# EasyEDA Pro project grandPA2.eprj, board main
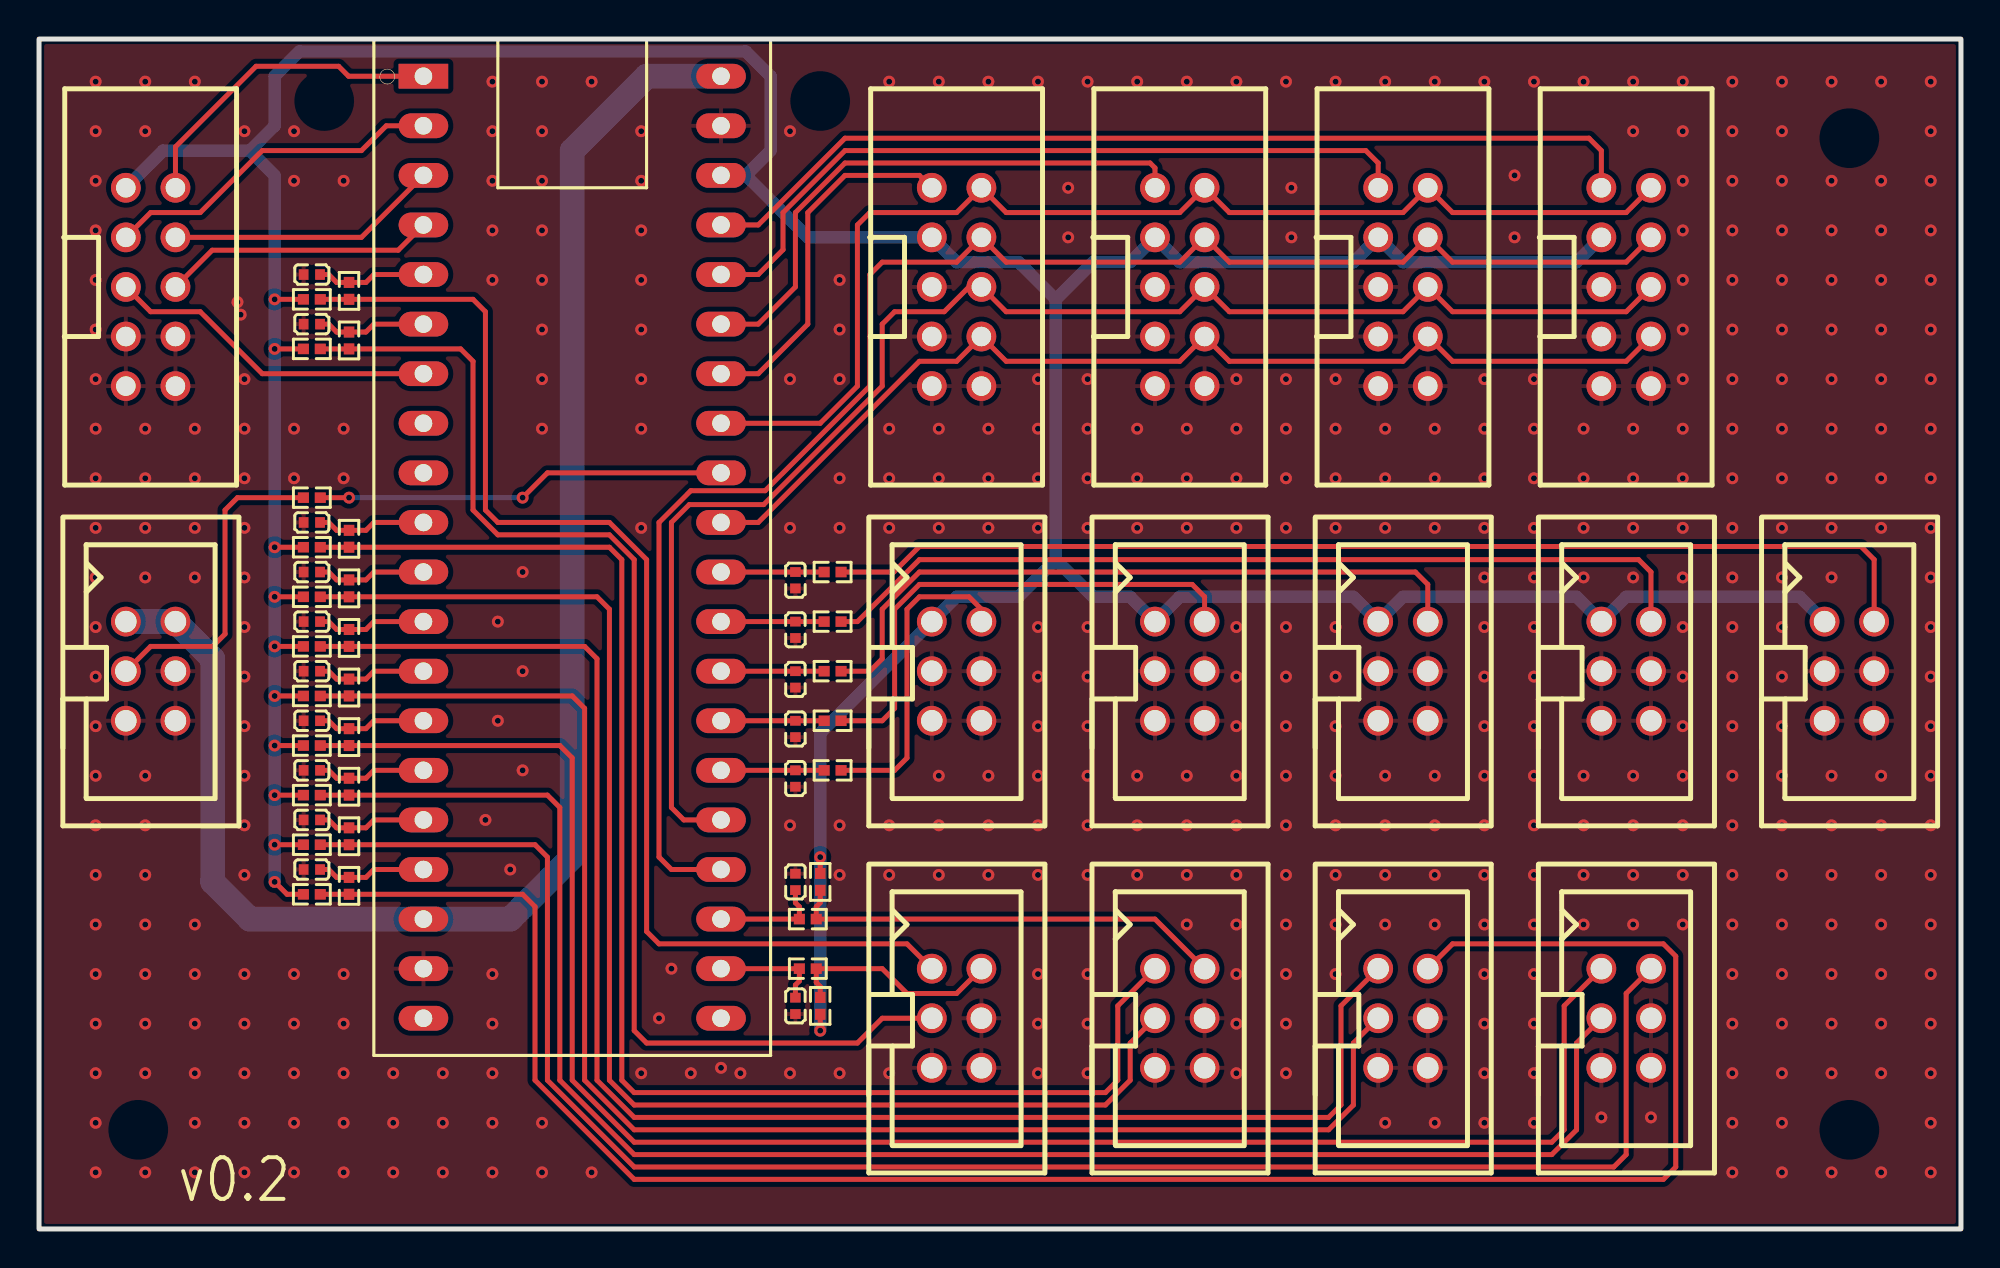
[diagram p8: board, top side]
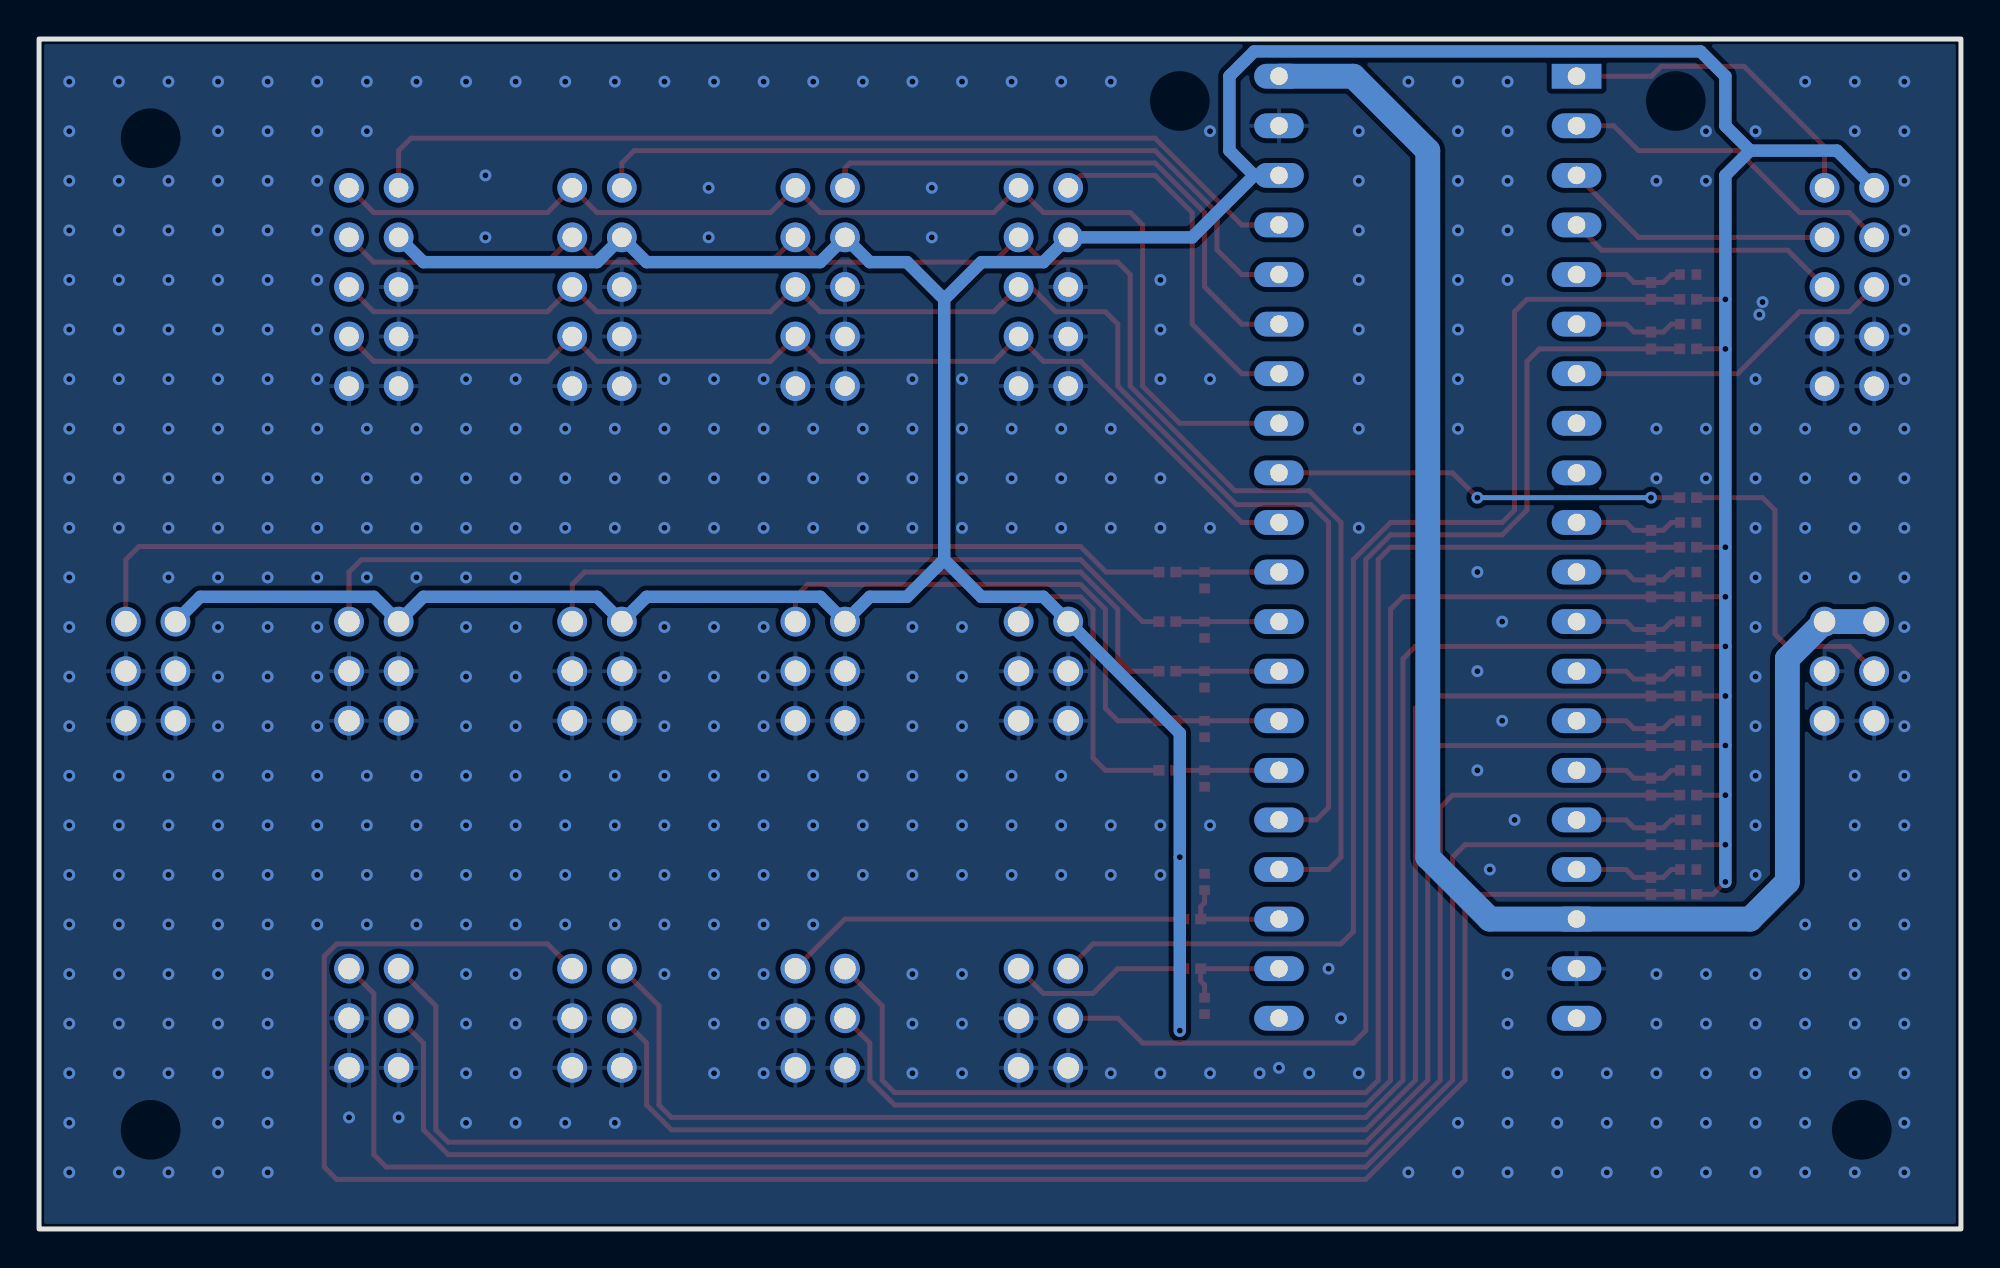
[diagram p9: board, bottom side, seen from below]

Outline 98.42 x 60.96 mm; copper layers: Top Layer, Bottom Layer. Coordinates in mm from the lower left corner of the outline.
Outline path: rectangle 0,60.96 98.42,0
Stack: Top Layer 0.035mm / Dielectric1 1.51mm FR4 er 4.5 / Bottom Layer 0.035mm

## Design rules (mm)
template: JLCPCB Capability(Two Layers Board)
spacing copperThickness1oz (default): track to track 0.102, other pairs 0.152 to 0.3
spacing copperThickness2oz: track to track 0.203, other pairs 0.152 to 0.3
track width copperThickness1oz (default): min 0.127, default 0.254, max 2.54
track width copperThickness2oz: min 0.203, default 0.254, max 2.54
differential pair differentialPair (default): width min 0.127, default 0.254, max 2.54; gap min 0.152, default 0.152
via viaSize (default): diameter min 0.5, default 0.61, max 10; hole min 0.3, default 0.305, max 6.3

## Placement (name value [footprint] x y rotation side)
C3  10nF  [C0402]  13.97 46.36 0 top
C5  100nF  [C0402]  38.73 11.43 270 top
C6  10nF  [C0402]  13.97 48.9 0 top
C7  100nF  [C0402]  38.73 33.24 270 top
C17  100nF  [C0402]  38.73 23.08 270 top
C18  100nF  [C0402]  38.73 25.62 270 top
C19  100nF  [C0402]  38.73 28.16 270 top
C20  100nF  [C0402]  38.73 30.7 270 top
C21  10nF  [C0402]  13.97 36.2 0 top
C22  100nF  [C0402]  38.73 17.78 90 top
C23  10nF  [C0402]  13.97 33.66 0 top
C27  10nF  [C0402]  13.97 26.04 0 top
C28  100nF  [C0402]  13.97 20.96 180 top
C29  10nF  [C0402]  13.97 23.5 0 top
C30  10nF  [C0402]  13.97 31.12 0 top
C31  100nF  [C0402]  13.97 18.42 180 top
C32  10nF  [C0402]  13.97 28.58 0 top
P6  2.54-2*5P简牛  [IDC-TH_10P-P2.54_C5665]  5.72 48.26 270 top
P7  2.54-2*3P简牛  [IDC-TH_6P-P2.54_C11214]  5.72 28.58 270 top
P12  2.54-2*3P简牛  [IDC-TH_6P-P2.54_C11214]  46.99 10.8 270 top
P13  2.54-2*3P简牛  [IDC-TH_6P-P2.54_C11214]  92.71 28.58 270 top
P18  2.54-2*3P简牛  [IDC-TH_6P-P2.54_C11214]  58.42 10.8 270 top
P19  2.54-2*3P简牛  [IDC-TH_6P-P2.54_C11214]  69.85 10.8 270 top
P20  2.54-2*3P简牛  [IDC-TH_6P-P2.54_C11214]  81.28 10.8 270 top
P21  2.54-2*5P简牛  [IDC-TH_10P-P2.54_C5665]  46.99 48.26 270 top
P22  2.54-2*5P简牛  [IDC-TH_10P-P2.54_C5665]  69.85 48.26 270 top
P23  2.54-2*5P简牛  [IDC-TH_10P-P2.54_C5665]  58.42 48.26 270 top
P24  2.54-2*5P简牛  [IDC-TH_10P-P2.54_C5665]  81.28 48.26 270 top
P25  2.54-2*3P简牛  [IDC-TH_6P-P2.54_C11214]  46.99 28.58 270 top
P26  2.54-2*3P简牛  [IDC-TH_6P-P2.54_C11214]  58.42 28.58 270 top
P27  2.54-2*3P简牛  [IDC-TH_6P-P2.54_C11214]  69.85 28.58 270 top
P28  2.54-2*3P简牛  [IDC-TH_6P-P2.54_C11214]  81.28 28.58 270 top
R1  470Ω  [R0402]  13.97 37.47 180 top
R5  1kΩ  [R0402]  39.37 13.34 0 top
R6  10kΩ  [R0402]  13.97 45.09 180 top
R7  10kΩ  [R0402]  15.88 45.52 270 top
R9  10kΩ  [R0402]  13.97 47.63 180 top
R10  10kΩ  [R0402]  15.88 48.06 270 top
R11  10kΩ  [R0402]  40.01 11.43 270 top
R12  1kΩ  [R0402]  40.64 33.66 0 top
R31  1kΩ  [R0402]  40.64 23.5 0 top
R32  1kΩ  [R0402]  40.64 26.04 0 top
R33  1kΩ  [R0402]  40.64 28.58 0 top
R34  1kΩ  [R0402]  40.64 31.12 0 top
R35  10kΩ  [R0402]  13.97 34.93 180 top
R36  10kΩ  [R0402]  15.88 35.36 270 top
R37  1kΩ  [R0402]  39.37 15.88 0 top
R38  10kΩ  [R0402]  40.01 17.78 90 top
R39  10kΩ  [R0402]  13.97 32.39 180 top
R40  10kΩ  [R0402]  15.88 32.82 270 top
R47  10kΩ  [R0402]  13.97 24.77 180 top
R48  10kΩ  [R0402]  15.88 25.2 270 top
R49  1kΩ  [R0402]  15.88 20.12 270 top
R50  10kΩ  [R0402]  13.97 19.69 180 top
R51  10kΩ  [R0402]  13.97 22.23 180 top
R52  10kΩ  [R0402]  15.88 22.66 270 top
R53  10kΩ  [R0402]  13.97 29.85 180 top
R54  10kΩ  [R0402]  15.88 30.28 270 top
R55  1kΩ  [R0402]  15.88 17.58 270 top
R56  10kΩ  [R0402]  13.97 17.15 180 top
R57  10kΩ  [R0402]  13.97 27.31 180 top
R58  10kΩ  [R0402]  15.88 27.74 270 top
U1  BlackPill  [Z_module_black_pill_STM32F411]  27.31 34.93 270 top

## Footprints (pads in the part's own frame, mm; a bottom-side part is the same pattern mirrored in y, then rotated)
C0402
  rect 0.5x0.54 smd: 1(-0.42,0) 2(0.42,0)
IDC-TH_6P-P2.54_C11214
  round 1.524 hole 1.1: 1(-2.54,-1.27) 2(-2.54,1.27) 3(0,-1.27) 4(0,1.27) 5(2.54,-1.27) 6(2.54,1.27)
IDC-TH_10P-P2.54_C5665
  round 1.524 hole 1: 1(-5.08,-1.27) 2(-5.08,1.27) 3(-2.54,-1.27) 4(-2.54,1.27) 5(0,-1.27) 6(0,1.27) 7(2.54,-1.27) 8(2.54,1.27) 9(5.08,-1.27) 10(5.08,1.27)
R0402
  rect 0.566x0.54 smd: 1(-0.433,0) 2(0.433,0)
Z_module_black_pill_STM32F411
  rect 1.27x2.54 hole 0.9: 1(-24.13,-7.62)
  oval 1.27x2.54 hole 0.9: 2(-21.59,-7.62) 3(-19.05,-7.62) 4(-16.51,-7.62) 5(-13.97,-7.62) 6(-11.43,-7.62) 7(-8.89,-7.62) 8(-6.35,-7.62) 9(-3.81,-7.62) 10(-1.27,-7.62) 11(1.27,-7.62) 12(3.81,-7.62) 13(6.35,-7.62) 14(8.89,-7.62) 15(11.43,-7.62) 16(13.97,-7.62) 17(16.51,-7.62) 18(19.05,-7.62) 19(21.59,-7.62) 20(24.13,-7.62) 21(24.13,7.62) 22(21.59,7.62) 23(19.05,7.62) 24(16.51,7.62) 25(13.97,7.62) 26(11.43,7.62) 27(8.89,7.62) 28(6.35,7.62) 29(3.81,7.62) 30(1.27,7.62) 31(-1.27,7.62) 32(-3.81,7.62) 33(-6.35,7.62) 34(-8.89,7.62) 35(-11.43,7.62) 36(-13.97,7.62) 37(-16.51,7.62) 38(-19.05,7.62) 39(-21.59,7.62) 40(-24.13,7.62)

## Nets
As in the schematic.

Pads without a net: U1 8 9 20 21

## Via types
v1: diameter 0.61, hole 0.305, Top Layer to Bottom Layer, 468 vias

## Routing (per net, layer and track width the routed paths; a pad name or vN(x,y) marks a point on that pad's centre or on a via; arc(x,y) is an arc through that point)
3V3: length 237.5
  Top Layer w0.254: R39.2 v1(12.07,32.39) ; R50.2 v1(12.07,19.69) ; R9.2 v1(12.07,47.63) ; R35.2 v1(12.07,34.93) ; R6.2 v1(12.07,45.09) ; R56.2 12.7,17.15 v1(12.07,17.78) ; R57.2 v1(12.07,27.31) ; R51.2 v1(12.07,22.23) ; R53.2 v1(12.07,29.85) ; R11.2 v1(40.01,10.16) ; R47.2 v1(12.07,24.77) ; R38.2 v1(40.01,19.05)
  Bottom Layer w0.635: v1(40.01,10.16) v1(40.01,19.05) 40.01,25.4 P25.1 46.99,32.39 50.17,32.39 52.07,34.29 ; P24.3 78.74,49.53 69.85,49.53 P22.3 67.31,49.53 58.42,49.53 57.15,50.8 55.88,49.53 53.98,49.53 52.07,47.63 ; 52.07,47.63 52.07,34.29 ; 52.07,47.63 50.17,49.53 46.99,49.53 P21.3 39.37,50.8 36.2,53.98 ; 52.07,34.29 53.98,32.39 55.88,32.39 57.15,31.12 58.42,32.39 67.31,32.39 P27.1 69.85,32.39 78.74,32.39 P28.1 81.28,32.39 90.17,32.39 P13.1 ; 36.2,53.98 37.47,55.25 37.47,59.06 36.2,60.33 13.34,60.33 12.07,59.06 12.07,56.52 10.8,55.25 ; 36.2,53.98 U1.38 ; 10.8,55.25 6.35,55.25 P6.1 ; 10.8,55.25 12.07,53.98 v1(12.07,47.63) v1(12.07,45.09) v1(12.07,34.93) v1(12.07,32.39) v1(12.07,29.85) v1(12.07,27.31) v1(12.07,24.77) v1(12.07,22.23) v1(12.07,19.69) v1(12.07,17.78)
5V: length 82.6
  Bottom Layer w1.27: P7.1 P7.2 8.89,29.21 8.89,17.78 10.8,15.88 U1.18 24.13,15.88 27.31,19.05 27.31,55.25 31.12,59.06 U1.40
GND:
  vias: v1(2.9,58.78) v1(2.9,56.24) v1(2.9,53.7) v1(2.9,51.16) v1(2.9,48.62) v1(2.9,46.08) v1(2.9,43.54) v1(2.9,41) v1(2.9,38.46) v1(2.9,35.92) v1(2.9,33.38) v1(2.9,30.84) v1(2.9,28.3) v1(2.9,25.76) v1(2.9,23.22) v1(2.9,20.68) v1(2.9,18.14) v1(2.9,15.6) v1(2.9,13.06) v1(2.9,10.52) v1(2.9,7.98) v1(2.9,5.44) v1(2.9,2.9) v1(5.44,58.78) v1(5.44,56.24) v1(5.44,41) v1(5.44,38.46) v1(5.44,35.92) v1(5.44,33.38) v1(5.44,23.22) v1(5.44,20.68) v1(5.44,18.14) v1(5.44,15.6) v1(5.44,13.06) v1(5.44,10.52) v1(5.44,7.98) v1(5.44,2.9) v1(7.98,58.78) v1(7.98,41) v1(7.98,38.46) v1(7.98,35.92) v1(7.98,33.38) v1(7.98,15.6) v1(7.98,13.06) v1(7.98,10.52) v1(7.98,7.98) v1(7.98,5.44) v1(7.98,2.9) v1(10.16,47.48) v1(10.32,46.84) v1(10.52,56.24) v1(10.52,43.54) v1(10.52,41) v1(10.52,38.46) v1(10.52,35.92) v1(10.52,33.38) v1(10.52,30.84) v1(10.52,28.3) v1(10.52,25.76) v1(10.52,23.22) v1(10.52,20.68) v1(10.52,18.14) v1(10.52,13.06) v1(10.52,10.52) v1(10.52,7.98) v1(10.52,5.44) v1(10.52,2.9) v1(13.06,56.24) v1(13.06,53.7) v1(13.06,41) v1(13.06,38.46) v1(13.06,13.06) v1(13.06,10.52) v1(13.06,7.98) v1(13.06,5.44) v1(13.06,2.9) v1(15.6,53.7) v1(15.6,41) v1(15.6,38.46) v1(15.6,13.06) v1(15.6,10.52) v1(15.6,7.98) v1(15.6,5.44) v1(15.6,2.9) v1(18.14,7.98) v1(18.14,5.44) v1(18.14,2.9) v1(20.68,7.98) v1(20.68,5.44) v1(20.68,2.9) v1(22.86,20.96) v1(23.22,58.78) v1(23.22,56.24) v1(23.22,53.7) v1(23.22,51.16) v1(23.22,48.62) v1(23.22,13.06) v1(23.22,10.52) v1(23.22,7.98) v1(23.22,5.44) v1(23.22,2.9) v1(23.5,31.12) v1(23.5,26.04) v1(24.13,18.42) v1(24.77,33.66) v1(24.77,28.58) v1(24.77,23.5) v1(25.76,58.78) v1(25.76,56.24) v1(25.76,53.7) v1(25.76,51.16) v1(25.76,48.62) v1(25.76,46.08) v1(25.76,43.54) v1(25.76,41) v1(25.76,5.44) v1(25.76,2.9) v1(28.3,58.78) v1(28.3,2.9) v1(30.84,56.24) v1(30.84,53.7) v1(30.84,51.16) v1(30.84,48.62) v1(30.84,46.08) v1(30.84,43.54) v1(30.84,41) v1(30.84,35.92) v1(30.84,7.98) v1(31.75,10.8) v1(32.39,13.34) v1(33.38,7.98) v1(34.92,8.26) v1(35.92,7.98) v1(38.46,56.24) v1(38.46,43.54) v1(38.46,35.92) v1(38.46,20.68) v1(38.46,7.98) v1(41,48.62) v1(41,46.08) v1(41,43.54) v1(41,38.46) v1(41,35.92) v1(41,20.68) v1(41,18.14) v1(41,7.98) v1(43.54,58.78) v1(43.54,41) v1(43.54,38.46) v1(43.54,35.92) v1(43.54,20.68) v1(43.54,18.14) v1(43.54,7.98) v1(46.08,58.78) v1(46.08,41) v1(46.08,38.46) v1(46.08,35.92) v1(46.08,23.22) v1(46.08,20.68) v1(46.08,18.14) v1(48.62,58.78) v1(48.62,41) v1(48.62,38.46) v1(48.62,35.92) v1(48.62,23.22) v1(48.62,20.68) v1(48.62,18.14) v1(51.16,58.78) v1(51.16,43.54) v1(51.16,41) v1(51.16,38.46) v1(51.16,35.92) v1(51.16,30.84) v1(51.16,28.3) v1(51.16,25.76) v1(51.16,23.22) v1(51.16,20.68) v1(51.16,18.14) v1(51.16,13.06) v1(51.16,10.52) v1(51.16,7.98) v1(52.7,53.34) v1(52.7,50.8) v1(53.7,58.78) v1(53.7,43.54) v1(53.7,41) v1(53.7,38.46) v1(53.7,35.92) v1(53.7,30.84) v1(53.7,28.3) v1(53.7,25.76) v1(53.7,23.22) v1(53.7,20.68) v1(53.7,18.14) v1(53.7,13.06) v1(53.7,10.52) v1(53.7,7.98) v1(56.24,58.78) v1(56.24,41) v1(56.24,38.46) v1(56.24,35.92) v1(56.24,23.22) v1(56.24,20.68) v1(56.24,18.14) v1(58.78,58.78) v1(58.78,41) v1(58.78,38.46) v1(58.78,35.92) v1(58.78,23.22) v1(58.78,20.68) v1(58.78,18.14) v1(58.78,15.6) v1(61.32,58.78) v1(61.32,43.54) v1(61.32,41) v1(61.32,38.46) v1(61.32,35.92) v1(61.32,30.84) v1(61.32,28.3) v1(61.32,25.76) v1(61.32,23.22) v1(61.32,20.68) v1(61.32,18.14) v1(61.32,15.6) v1(61.32,13.06) v1(61.32,10.52) v1(61.32,7.98) v1(63.86,58.78) v1(63.86,43.54) v1(63.86,41) v1(63.86,38.46) v1(63.86,35.92) v1(63.86,30.84) v1(63.86,28.3) v1(63.86,25.76) v1(63.86,23.22) v1(63.86,20.68) v1(63.86,18.14) v1(63.86,15.6) v1(63.86,13.06) v1(63.86,10.52) v1(63.86,7.98) v1(64.14,53.34) v1(64.14,50.8) v1(66.4,58.78) v1(66.4,43.54) v1(66.4,41) v1(66.4,38.46) v1(66.4,35.92) v1(66.4,30.84) v1(66.4,28.3) v1(66.4,25.76) v1(66.4,23.22) v1(66.4,20.68) v1(66.4,18.14) v1(66.4,15.6) v1(66.4,13.06) v1(68.94,58.78) v1(68.94,41) v1(68.94,38.46) v1(68.94,35.92) v1(68.94,23.22) v1(68.94,20.68) v1(68.94,18.14) v1(68.94,15.6) v1(68.94,5.44) v1(71.48,58.78) v1(71.48,41) v1(71.48,38.46) v1(71.48,35.92) v1(71.48,23.22) v1(71.48,20.68) v1(71.48,18.14) v1(71.48,15.6) v1(71.48,5.44) v1(74.02,58.78) v1(74.02,43.54) v1(74.02,41) v1(74.02,38.46) v1(74.02,35.92) v1(74.02,33.38) v1(74.02,30.84) v1(74.02,28.3) v1(74.02,25.76) v1(74.02,23.22) v1(74.02,20.68) v1(74.02,18.14) v1(74.02,15.6) v1(74.02,13.06) v1(74.02,10.52) v1(74.02,7.98) v1(74.02,5.44) v1(75.57,53.98) v1(75.57,50.8) v1(76.56,58.78) v1(76.56,43.54) v1(76.56,41) v1(76.56,38.46) v1(76.56,35.92) v1(76.56,33.38) v1(76.56,30.84) v1(76.56,28.3) v1(76.56,25.76) v1(76.56,23.22) v1(76.56,20.68) v1(76.56,18.14) v1(76.56,15.6) v1(76.56,13.06) v1(76.56,10.52) v1(76.56,7.98) v1(76.56,5.44) v1(79.1,58.78) v1(79.1,41) v1(79.1,38.46) v1(79.1,35.92) v1(79.1,33.38) v1(79.1,23.22) v1(79.1,20.68) v1(79.1,18.14) v1(79.1,15.6) v1(80.01,5.72) v1(81.64,58.78) v1(81.64,56.24) v1(81.64,41) v1(81.64,38.46) v1(81.64,35.92) v1(81.64,33.38) v1(81.64,23.22) v1(81.64,20.68) v1(81.64,18.14) v1(81.64,15.6) v1(82.55,5.72) v1(84.18,58.78) v1(84.18,56.24) v1(84.18,53.7) v1(84.18,51.16) v1(84.18,48.62) v1(84.18,46.08) v1(84.18,43.54) v1(84.18,41) v1(84.18,38.46) v1(84.18,35.92) v1(84.18,33.38) v1(84.18,30.84) v1(84.18,28.3) v1(84.18,25.76) v1(84.18,23.22) v1(84.18,20.68) v1(84.18,18.14) v1(84.18,15.6) v1(86.72,58.78) v1(86.72,56.24) v1(86.72,53.7) v1(86.72,51.16) v1(86.72,48.62) v1(86.72,46.08) v1(86.72,43.54) v1(86.72,41) v1(86.72,38.46) v1(86.72,35.92) v1(86.72,33.38) v1(86.72,30.84) v1(86.72,28.3) v1(86.72,25.76) v1(86.72,23.22) v1(86.72,20.68) v1(86.72,18.14) v1(86.72,15.6) v1(86.72,13.06) v1(86.72,10.52) v1(86.72,7.98) v1(86.72,5.44) v1(86.72,2.9) v1(89.26,58.78) v1(89.26,56.24) v1(89.26,53.7) v1(89.26,51.16) v1(89.26,48.62) v1(89.26,46.08) v1(89.26,43.54) v1(89.26,41) v1(89.26,38.46) v1(89.26,35.92) v1(89.26,33.38) v1(89.26,30.84) v1(89.26,28.3) v1(89.26,25.76) v1(89.26,23.22) v1(89.26,20.68) v1(89.26,18.14) v1(89.26,15.6) v1(89.26,13.06) v1(89.26,10.52) v1(89.26,7.98) v1(89.26,5.44) v1(89.26,2.9) v1(91.8,58.78) v1(91.8,53.7) v1(91.8,51.16) v1(91.8,48.62) v1(91.8,46.08) v1(91.8,43.54) v1(91.8,41) v1(91.8,38.46) v1(91.8,35.92) v1(91.8,33.38) v1(91.8,23.22) v1(91.8,20.68) v1(91.8,18.14) v1(91.8,15.6) v1(91.8,13.06) v1(91.8,10.52) v1(91.8,7.98) v1(91.8,2.9) v1(94.34,58.78) v1(94.34,53.7) v1(94.34,51.16) v1(94.34,48.62) v1(94.34,46.08) v1(94.34,43.54) v1(94.34,41) v1(94.34,38.46) v1(94.34,35.92) v1(94.34,23.22) v1(94.34,20.68) v1(94.34,18.14) v1(94.34,15.6) v1(94.34,13.06) v1(94.34,10.52) v1(94.34,7.98) v1(94.34,2.9) v1(96.88,58.78) v1(96.88,56.24) v1(96.88,53.7) v1(96.88,51.16) v1(96.88,48.62) v1(96.88,46.08) v1(96.88,43.54) v1(96.88,41) v1(96.88,38.46) v1(96.88,35.92) v1(96.88,33.38) v1(96.88,30.84) v1(96.88,28.3) v1(96.88,25.76) v1(96.88,23.22) v1(96.88,20.68) v1(96.88,18.14) v1(96.88,15.6) v1(96.88,13.06) v1(96.88,10.52) v1(96.88,7.98) v1(96.88,5.44) v1(96.88,2.9)
DP0_CS: length 18.6
  Top Layer w0.254: P21.1 45.08,53.98 41.28,53.98 39.37,52.07 39.37,46.36 36.83,43.82 U1.34
DP1_CS: length 29
  Top Layer w0.254: U1.35 36.83,46.36 38.73,48.26 38.73,52.07 41.28,54.61 56.9,54.61 57.15,54.36 57.15,53.34
DP2_CS: length 38.9
  Top Layer w0.254: U1.36 36.83,48.9 38.1,50.17 38.1,52.07 41.28,55.25 67.95,55.25 68.58,54.61 P22.1
DP3_CS: length 49.1
  Top Layer w0.254: U1.37 36.83,51.44 41.28,55.88 79.38,55.88 80.01,55.25 P24.1
DP_DC: length 83.9
  Top Layer w0.254: U1.24 32.39,18.42 31.75,19.05 31.75,36.2 33.38,37.82 37.19,37.82 42.55,43.18 42.55,48.9 43.18,49.53 46.99,49.53 P21.4 49.53,49.53 58.42,49.53 P23.4 60.96,49.53 69.85,49.53 P22.4 72.39,49.53 81.28,49.53 P24.4
DP_MOSI: length 60.6
  Top Layer w0.254: U1.33 40.01,41.28 41.91,43.18 41.91,51.44 42.55,52.07 46.99,52.07 P21.2 49.53,52.07 58.42,52.07 P23.2 60.96,52.07 69.85,52.07 P22.2 72.39,52.07 81.28,52.07 P24.2
DP_RST: length 77.6
  Top Layer w0.254: P24.6 81.28,46.99 72.39,46.99 P22.6 69.85,46.99 60.96,46.99 P23.6 58.42,46.99 49.53,46.99 P21.6 47.63,48.26 46.36,46.99 43.82,46.99 43.18,46.36 43.18,43.18 37.11,37.11 33.3,37.11 32.39,36.2 32.39,21.59 33.02,20.96 U1.25
DP_SCK: length 54.7
  Top Layer w0.254: P24.8 81.28,44.45 72.39,44.45 P22.8 69.85,44.45 60.96,44.45 P23.8 58.42,44.45 49.53,44.45 P21.8 46.99,44.45 45.08,44.45 36.83,36.2 U1.31
ENC0_A: length 5.6
  Top Layer w0.254: U1.5 17.15,48.9 16.74,48.49 15.24,48.49 14.84,48.9 C6.2
ENC0_B: length 5.6
  Top Layer w0.254: C3.2 14.84,46.36 15.24,45.95 16.74,45.95 17.15,46.36 U1.6
ENC0_BTN: length 5.6
  Top Layer w0.254: C5.1 38.73,12.5 38.94,12.7 R5.1 U1.22
ENC1_A: length 5.6
  Top Layer w0.254: C21.2 14.84,36.2 15.24,35.79 16.74,35.79 17.15,36.2 U1.10
ENC1_B: length 5.6
  Top Layer w0.254: U1.11 17.15,33.66 16.74,33.25 15.24,33.25 14.84,33.66 C23.2
ENC1_BTN: length 5.6
  Top Layer w0.254: C22.1 38.73,16.71 38.94,16.51 R37.1 U1.23
ENC2_A: length 5.6
  Top Layer w0.254: C30.2 14.84,31.12 15.24,30.71 16.74,30.71 17.15,31.12 U1.12
ENC2_B: length 5.6
  Top Layer w0.254: U1.13 17.15,28.58 16.74,28.17 15.24,28.17 14.84,28.58 C32.2
ENC2_BTN: length 5.6
  Top Layer w0.254: U1.17 17.15,18.42 16.74,18.01 15.24,18.01 14.84,18.42 C31.1
ENC3_A: length 5.6
  Top Layer w0.254: C27.2 14.84,26.04 15.24,25.63 16.74,25.63 17.15,26.04 U1.14
ENC3_B: length 5.6
  Top Layer w0.254: U1.15 17.15,23.5 16.74,23.09 15.24,23.09 14.84,23.5 C29.2
ENC3_BTN: length 5.6
  Top Layer w0.254: U1.16 17.15,20.96 16.74,20.55 15.24,20.55 14.84,20.96 C28.1
FAD0: length 5.3
  Top Layer w0.254: U1.26 C17.1 R31.1
FAD1: length 5.3
  Top Layer w0.254: R32.1 C18.1 U1.27
FAD2: length 5.3
  Top Layer w0.254: U1.28 C19.1 R33.1
FAD3: length 5.3
  Top Layer w0.254: U1.29 C20.1 R34.1
FAD4: length 5.3
  Top Layer w0.254: R12.1 C7.1 U1.30
LED: length 21
  Top Layer w0.254: v1(24.77,37.47) 26.04,38.74 U1.32 ; R1.1 v1(15.88,37.47)
  Bottom Layer w0.254: v1(24.77,37.47) v1(15.88,37.47)
MX_COLL: length 17.1
  Top Layer w0.254: U1.7 11.43,43.82 8.26,46.99 5.72,46.99 P6.5
MX_MISO: length 14
  Top Layer w0.254: U1.3 16.51,50.8 P6.4
MX_MOSI: length 14
  Top Layer w0.254: U1.4 18.39,50.14 8.87,50.14 P6.6
MX_ROWL: length 16.7
  Top Layer w0.254: U1.1 15.85,59.06 15.34,59.56 11.11,59.56 6.98,55.44 P6.2
MX_SCK: length 17.6
  Top Layer w0.254: U1.2 17.78,56.52 16.51,55.25 11.43,55.25 8.26,52.07 5.72,52.07 P6.3
$1N4893: length 62.6
  Top Layer w0.254: P12.1 44.45,14.61 31.75,14.61 31.12,15.24 31.12,34.29 29.21,36.2 23.5,36.2 22.86,36.83 22.86,46.99 22.23,47.63 R10.2 R9.1
$1N6245: length 65.2
  Top Layer w0.254: R6.1 R7.2 21.59,45.09 22.23,44.45 22.23,36.83 23.5,35.56 29.21,35.56 30.48,34.29 30.48,10.16 31.12,9.53 41.91,9.53 43.18,10.8 P12.3
$1N10974: length 25.8
  Top Layer w0.254: 41.28,26.04 43.18,26.04 43.82,26.67 43.82,31.75 45.08,33.02 59.05,33.02 59.69,32.39 P26.2
$1N11636: length 16.5
  Top Layer w0.254: R1.2 10.16,37.47 9.53,36.83 9.53,30.48 8.89,29.85 5.72,29.85 P7.3
$1N15576: length 11.1
  Top Layer w0.254: P12.2 46.99,12.07 44.45,12.07 43.18,13.34 R5.2 39.8,12.63 40.01,12.42 R11.1
$1N18301: length 70.6
  Top Layer w0.254: R39.1 R40.2 28.58,32.39 29.21,31.75 29.21,7.62 30.48,6.35 54.61,6.35 55.88,7.62 55.88,9.53 57.15,10.8
$1N18313: length 74.8
  Top Layer w0.254: R35.1 R36.2 29.21,34.93 29.85,34.29 29.85,7.62 30.48,6.99 54.61,6.99 55.25,7.62 55.25,11.43 57.15,13.34
$1N18314: length 22.5
  Top Layer w0.254: 40.01,17.35 40.01,16.71 39.8,16.51 R37.2 57.15,15.88 P18.2
$1N19975: length 86.9
  Top Layer w0.254: R51.1 R52.2 26.04,22.23 26.67,21.59 26.67,7.62 30.48,3.81 77.47,3.81 78.74,5.08 78.74,9.53 P20.3
$1N19978: length 91.1
  Top Layer w0.254: P20.1 78.11,11.43 78.11,5.08 77.47,4.45 30.48,4.45 27.31,7.62 27.31,24.13 26.67,24.77 R48.2 R47.1
$1N19980: length 90.7
  Top Layer w0.254: P20.2 81.28,12.07 81.28,3.81 80.64,3.18 30.48,3.18 26.04,7.62 26.04,19.05 25.4,19.69 R49.2 R50.1
$1N20351: length 78.8
  Top Layer w0.254: P19.3 67.31,9.53 67.31,6.35 66.04,5.08 30.48,5.08 27.94,7.62 27.94,26.67 27.31,27.31 R58.2 R57.1
$1N20354: length 83
  Top Layer w0.254: P19.1 66.67,11.43 66.67,6.35 66.04,5.72 30.48,5.72 28.58,7.62 28.58,29.21 27.94,29.85 R54.2 R53.1
$1N20356: length 105.2
  Top Layer w0.254: P19.2 72.39,14.61 83.19,14.61 83.82,13.97 83.82,3.18 83.19,2.54 30.48,2.54 25.4,7.62 25.4,16.51 24.77,17.15 R55.2 R56.1
$1N32435: length 16.2
  Top Layer w0.254: R31.2 43.82,23.5 44.45,24.13 44.45,31.75 45.08,32.39 47.63,32.39 48.26,31.75 P25.2
$1N32458: length 45.6
  Top Layer w0.254: R34.2 41.91,31.12 45.08,34.29 81.92,34.29 82.55,33.66 P28.2
$1N32469: length 35.8
  Top Layer w0.254: R33.2 42.55,28.58 43.18,29.21 43.18,31.75 45.08,33.66 70.48,33.66 71.12,33.02 P27.2
$1N32477: length 56.9
  Top Layer w0.254: P13.2 93.98,34.29 93.31,34.96 45.08,34.96 43.78,33.66 R12.2

## Copper pours and planes (outline as drawn; the poured copper is in the pictures)
GND on Top Layer: -1.9,60.96 99.7,60.96 99.7,0 -1.9,0
GND on Bottom Layer: -1.9,60.96 99.7,60.96 99.7,0 -1.9,0

## Text on the board
Top Silkscreen Layer: v0.2
